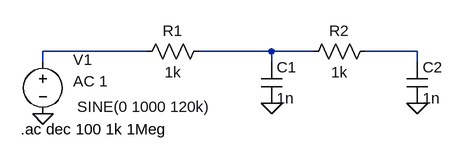
[diagram p0: schematic Draft1.asc]
Draft1.asc, the LTspice schematic file:
Version 4
SHEET 1 880 680
WIRE 0 -16 -160 -16
WIRE 192 -16 80 -16
WIRE 256 -16 192 -16
WIRE 416 -16 336 -16
WIRE -160 0 -160 -16
WIRE 192 0 192 -16
WIRE 416 0 416 -16
FLAG -160 80 0
FLAG 192 64 0
FLAG 416 64 0
SYMBOL res 96 -32 R90
WINDOW 0 0 56 VBottom 2
WINDOW 3 32 56 VTop 2
SYMATTR InstName R1
SYMATTR Value 1k
SYMBOL voltage -160 -16 R0
WINDOW 123 47 46 Left 2
WINDOW 39 0 0 Left 0
WINDOW 3 53 85 Left 2
WINDOW 0 47 13 Left 2
SYMATTR Value2 AC 1
SYMATTR Value SINE(0 1000 120k)
SYMATTR InstName V1
SYMBOL cap 176 0 R0
SYMATTR InstName C1
SYMATTR Value 1n
SYMBOL cap 400 0 R0
SYMATTR InstName C2
SYMATTR Value 1n
SYMBOL res 352 -32 R90
WINDOW 0 0 56 VBottom 2
WINDOW 3 32 56 VTop 2
SYMATTR InstName R2
SYMATTR Value 1k
TEXT -194 104 Left 2 !.ac dec 100 1k 1Meg

The netlist it stands for:
* Draft1.asc
R1 N002 N001 1k
V1 N001 0 SINE(0 1000 120k) AC 1
C1 N002 0 1n
C2 N003 0 1n
R2 N003 N002 1k
.ac dec 100 1k 1Meg
.backanno
.end